# Altium schematic sheet DC.SchDoc
size 685 x 800 mm
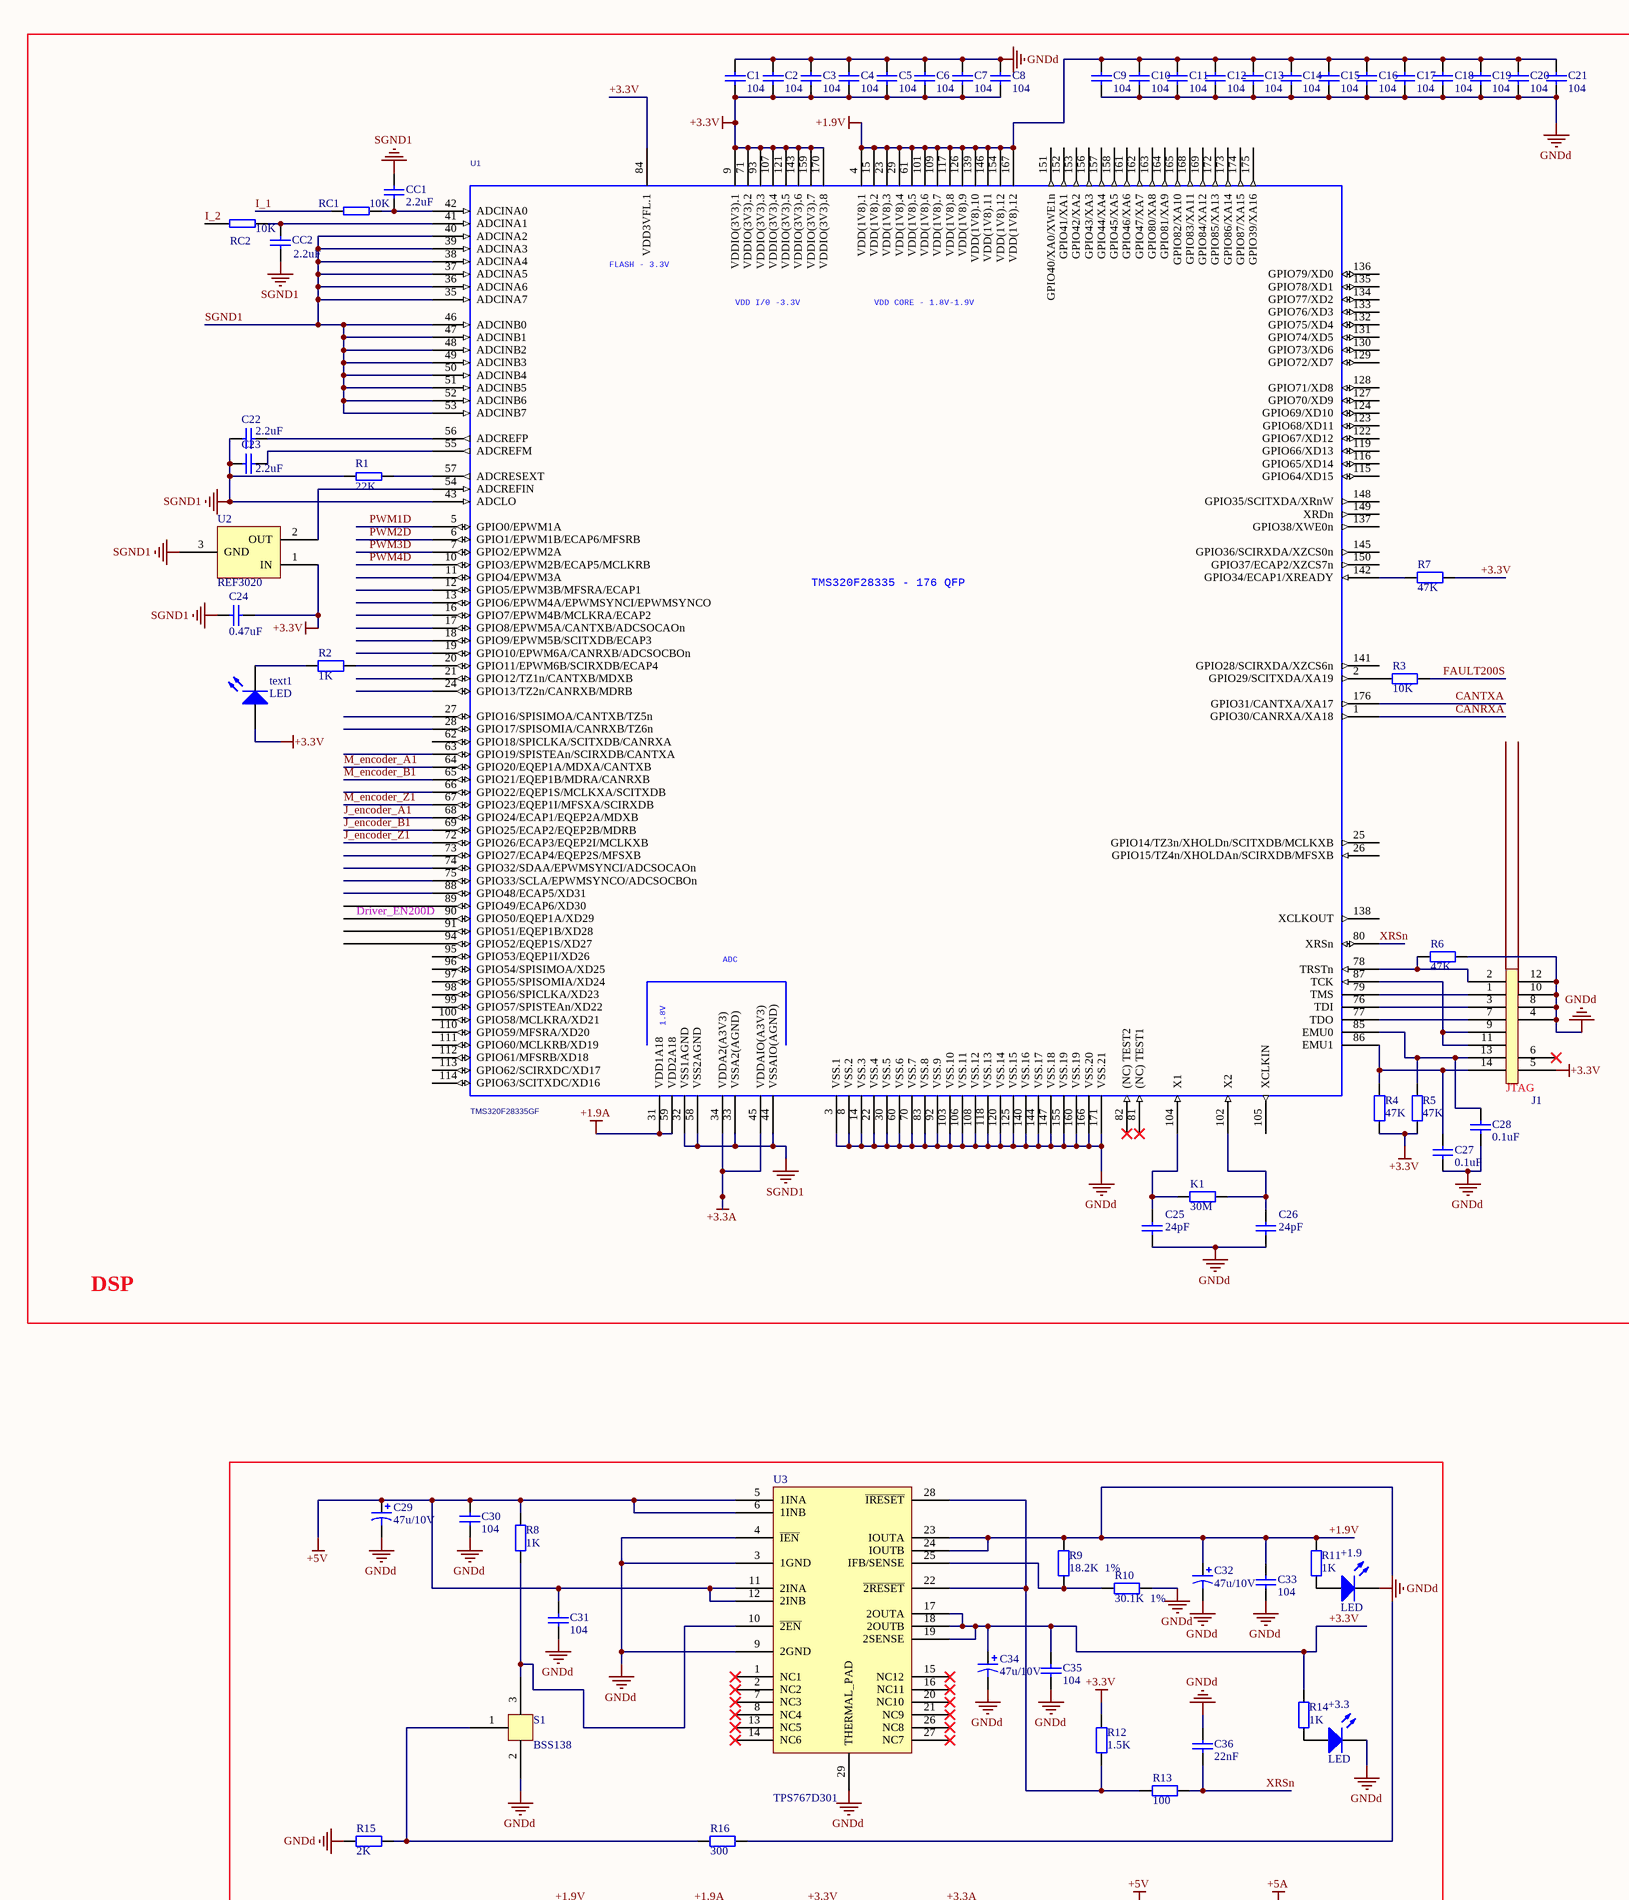
[diagram p0: DC.SchDoc, top left]
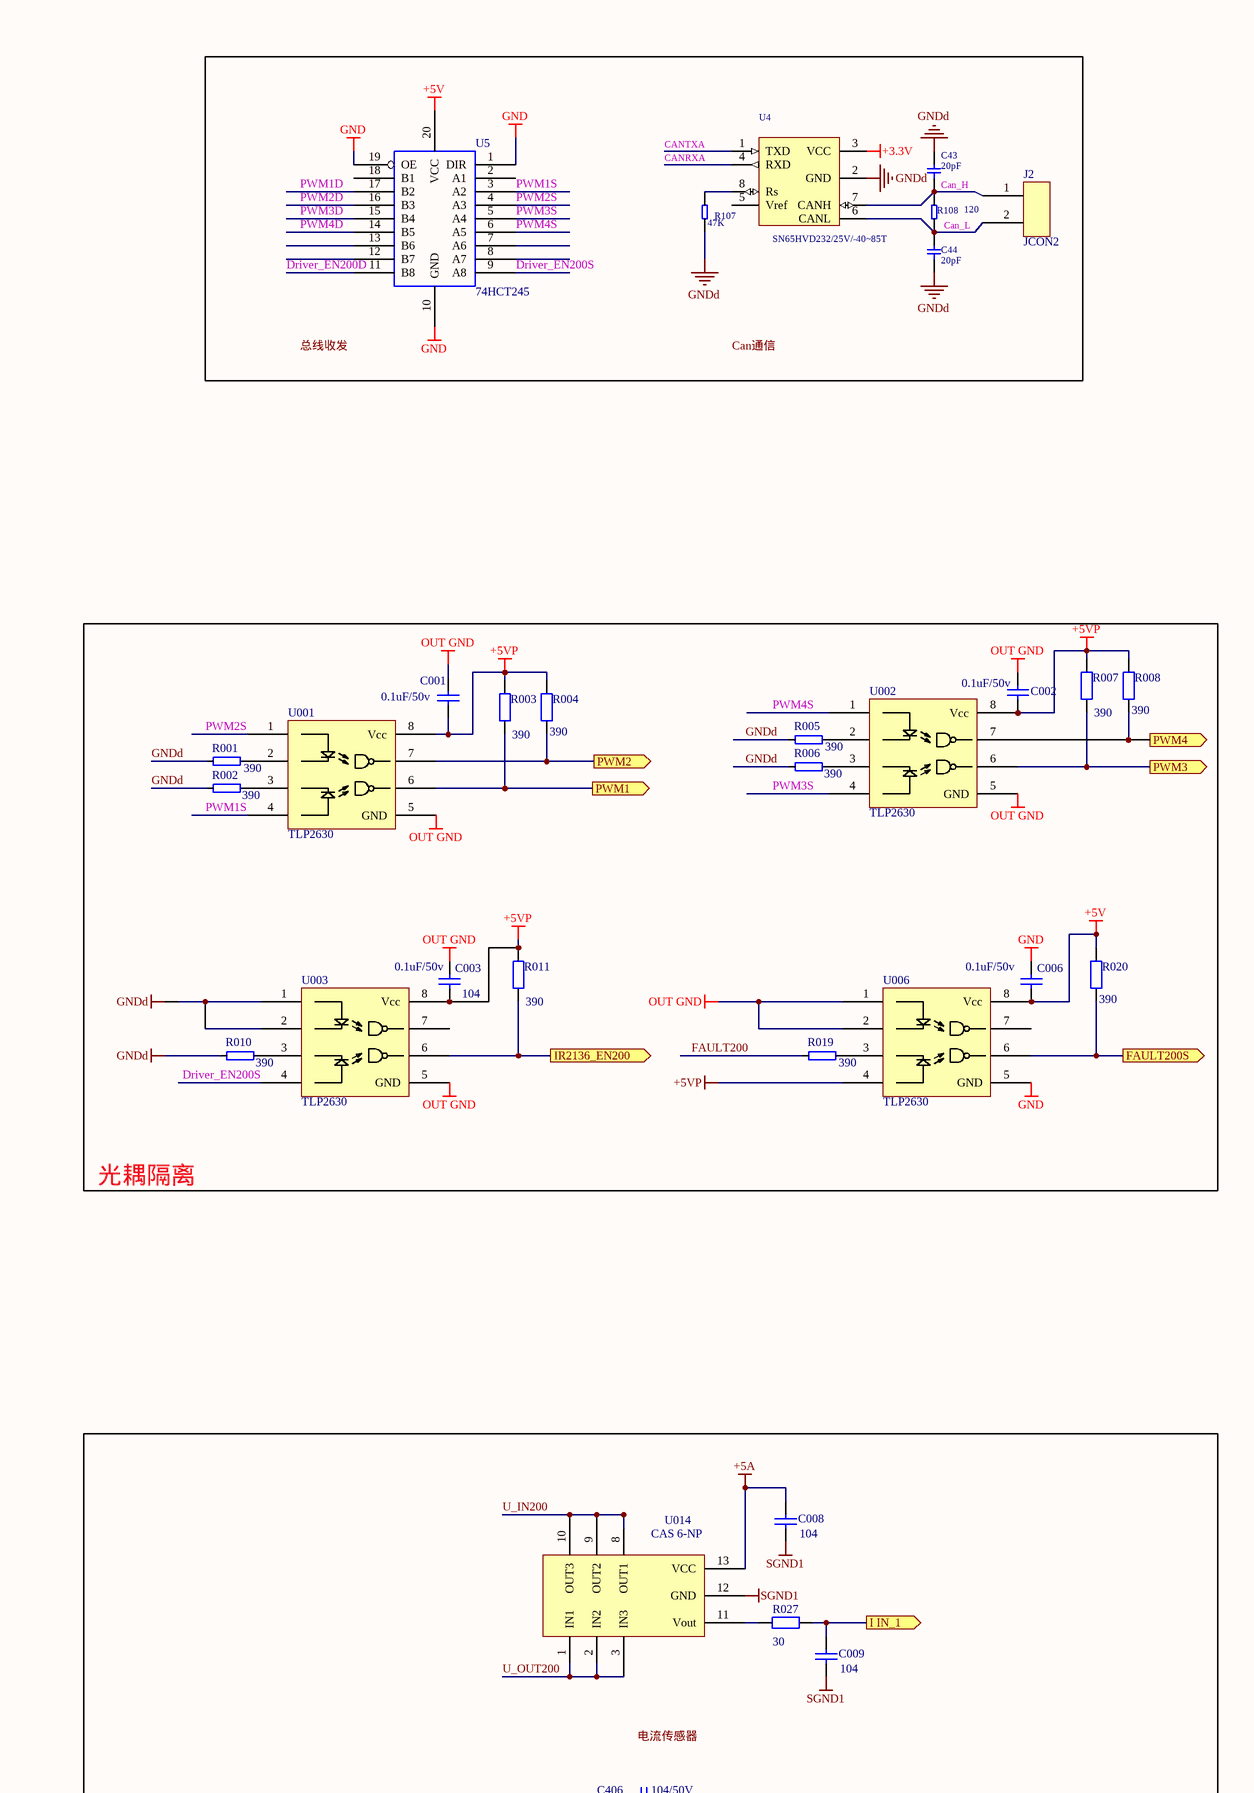
[diagram p1: DC.SchDoc, top right]
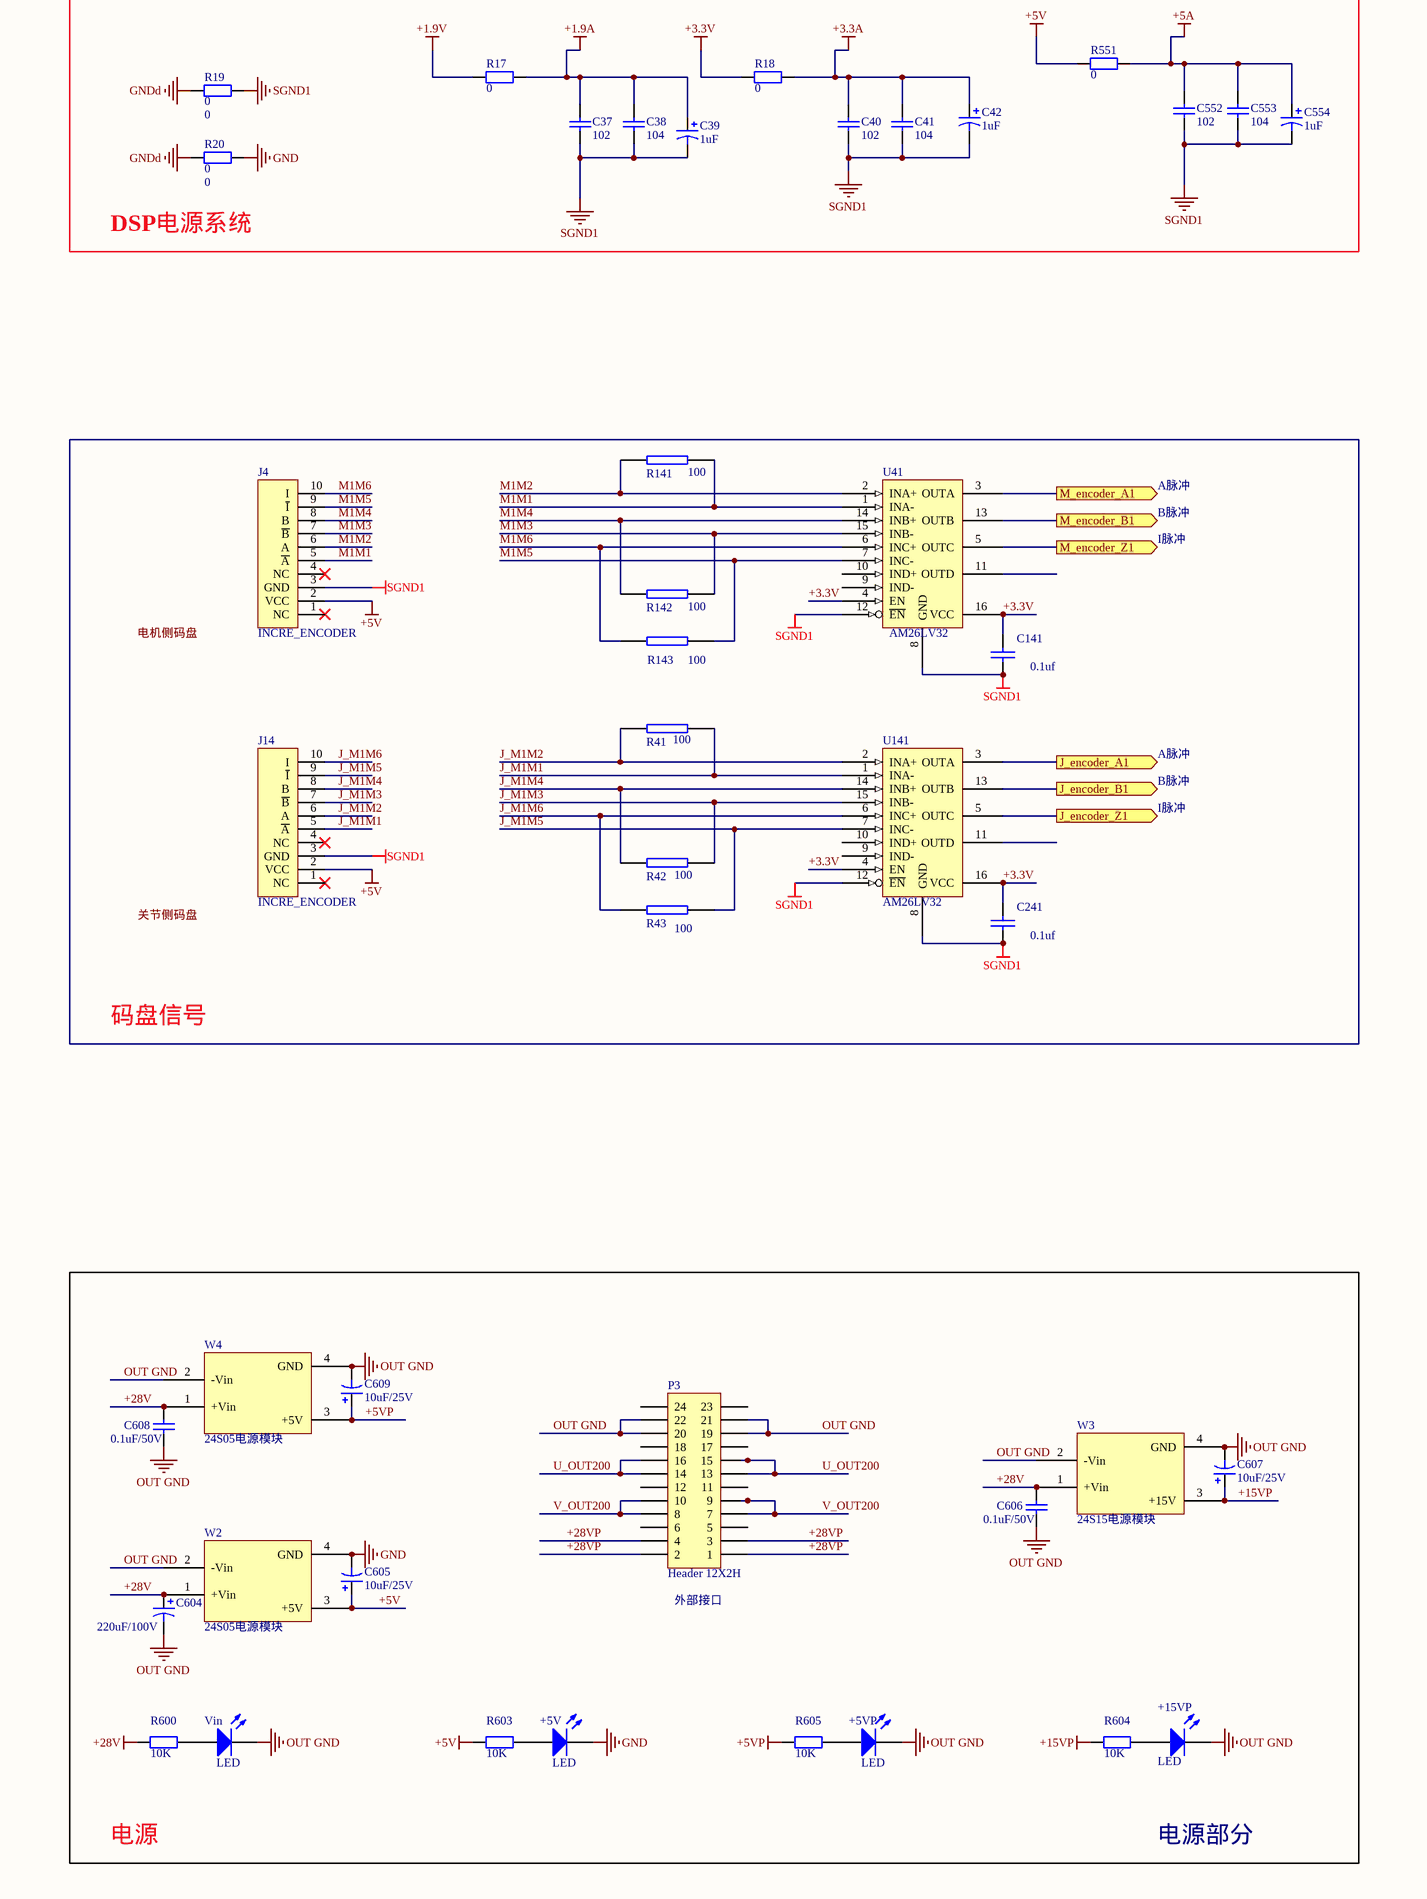
[diagram p2: DC.SchDoc, bottom left]
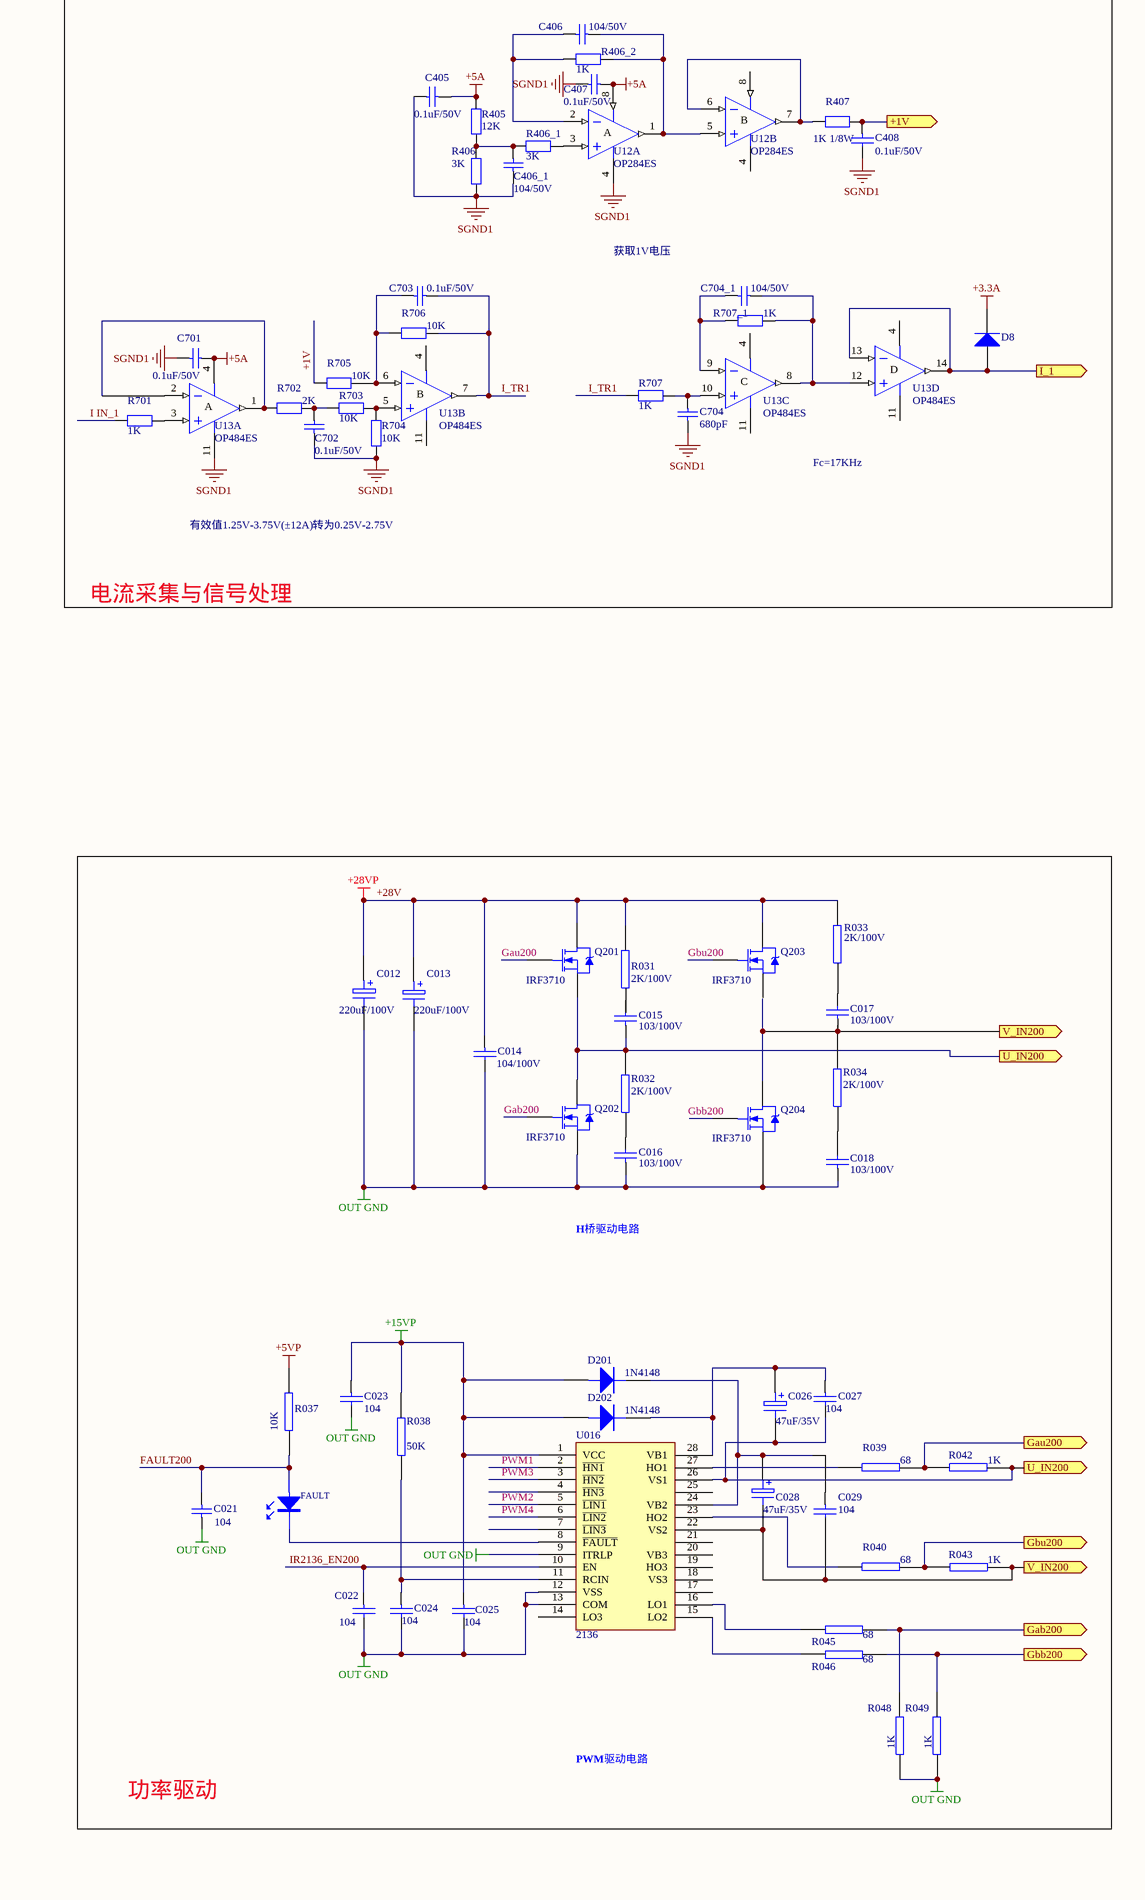
[diagram p3: DC.SchDoc, bottom right]

## Parts
+1.9  LED  [C0805 - LED]
+3.3  LED  [C0805 - LED]
+5V  LED  [C0805 - LED]
+5VP  LED  [C0805 - LED]
+15VP  LED  [C0805 - LED]
C1  104  [C0805]
C001  value 0.1uF/50v  [C0805]  (hidden comment: 104)
C2  104  [C0805]
C002  value 0.1uF/50v  [C0805]  (hidden comment: 104)
C3  104  [C0805]
C003  104  value 0.1uF/50v  [C0805]
C4  104  [C0805]
C5  104  [C0805]
C6  104  [C0805]
C006  value 0.1uF/50v  [C0805]  (hidden comment: 104)
C7  104  [C0805]
C8  104  [C0805]
C008  104  [C0805]
C9  104  [C0805]
C009  104  [C0805]
C10  104  [C0805]
C11  104  [C0805]
C12  104  [C0805]
C012  220uF/100V  [220uF/100V]
C13  104  [C0805]
C013  220uF/100V  [220uF/100V]
C14  104  [C0805]
C014  104/100V  [C0805]
C15  104  [C0805]
C015  103/100V  [C0805]
C16  104  [C0805]
C016  103/100V  [C0805]
C17  104  [C0805]
C017  103/100V  [C0805]
C18  104  [C0805]
C018  103/100V  [C0805]
C19  104  [C0805]
C20  104  [C0805]
C21  104  [C0805]
C021  104  [C0805]
C22  2.2uF  [6-0805]
C022  104  [C0805]
C23  2.2uF  [6-0805]
C023  104  [C0805]
C24  0.47uF  [C0805]
C024  104  [C0805]
C25  24pF  [C0805]
C025  104  [C0805]
C26  24pF  [C0805]
C026  47uF/35V  [7243]
C27  0.1uF  [C0805]
C027  104  [C0805]
C28  0.1uF  [C0805]
C028  47uF/35V  [7243]
C29  47u/10V  [钽电容2]
C029  104  [C0805]
C30  104  [C0805]
C31  104  [C0805]
C32  47u/10V  [钽电容2]
C33  104  [C0805]
C34  47u/10V  [钽电容2]
C35  104  [C0805]
C36  22nF  [C0805]
C37  102  [C0805]
C38  104  [C0805]
C39  1uF  [钽电容2]
C40  102  [C0805]
C41  104  [C0805]
C42  1uF  [钽电容2]
C43  20pF  [C0805]
C44  20pF  [C0805]
C141  0.1uF  [0603_LIU]
C241  0.1uF  [0603_LIU]
C405  0.1uF/50V  [C0805]
C406  104/50V  [C0805]
C406_1  104/50V  [C0805]
C407  0.1uF/50V  [C0805]
C408  0.1uF/50V  [C0805]
C552  102  [C0805]
C553  104  [C0805]
C554  1uF  [C0805]
C604  220uF/100V  [220uF/100V]
C605  10uF/25V  [25V10uF]
C606  0.1uF/50V  [C0805]
C607  10uF/25V  [25V10uF]
C608  0.1uF/50V  [C0805]
C609  10uF/25V  [25V10uF]
C701  0.1uF/50V  [C0805]
C702  0.1uF/50V  [C0805]
C703  0.1uF/50V  [C0805]
C704  680pF  [C0805]
C704_1  104/50V  [C0805]
CC1  2.2uF  [6-0805]
CC2  2.2uF  [6-0805]
D8  Diode  [1N58199]  (value not drawn)
D201  1N4148  [140T3]
D202  1N4148  [140T3]
FAULT  LED  [C0805 - LED]  (value not drawn)
J1  JTAG  [HDR2X7]
J2  JCON2  [J2]
J4  INCRE_ENCODER  [MAPAN]
J14  INCRE_ENCODER  [MAPAN]
K1  30M  [晶振]
P3  Header 12X2H  [HDR2X12H]
Q201  IRF3710  [D2Pak]
Q202  IRF3710  [D2Pak]
Q203  IRF3710  [D2Pak]
Q204  IRF3710  [D2Pak]
R1  22K  [0805]
R001  390  [0805]
R2  1K  [0805]
R002  390  [0805]
R003  390  [0805]
R3  10K  [0805]
R4  47K  [0805]
R004  390  [0805]
R5  47K  [0805]
R005  390  [0805]
R6  47K  [0805]
R006  390  [0805]
R7  47K  [0805]
R007  390  [0805]
R8  1K  [0805]
R008  390  [0805]
R9  18.2K  1%  [0805]
R10  30.1K  1%  [0805]
R010  390  [0805]
R11  1K  [0805]
R011  390  [0805]
R12  1.5K  [0805]
R13  100  [0805]
R14  1K  [0805]
R15  2K  [0805]
R16  300  [0805]
R17  0  [0805]
R18  0  [0805]
R19  0  [0805]
R019  390  [0805]
R020  390  [0805]
R20  0  [0805]
R027  30  [0805]
R031  2K/100V  [0805]
R032  2K/100V  [0805]
R033  2K/100V  [0805]
R034  2K/100V  [0805]
R037  10K  [0805]
R038  50K  [0805]
R039  68  [0805]
R040  68  [0805]
R41  100  [0603_LIU]
R042  1K  [0805]
R42  100  [0603_LIU]
R043  1K  [0805]
R43  100  [0603_LIU]
R045  68  [0805]
R046  68  [0805]
R048  1K  [0805]
R049  1K  [0805]
R107  47K  [0805]
R108  120  [0805]
R141  100  [0603_LIU]
R142  100  [0603_LIU]
R143  100  [0603_LIU]
R405  12K  [0805]
R406  3K  [0805]
R406_1  3K  [0805]
R406_2  1K  [0805]
R407  1K 1/8W  [0805]
R551  0  [C0805]
R600  10K  [0805]
R603  10K  [0805]
R604  10K  [0805]
R605  10K  [0805]
R701  1K  [0805]
R702  2K  [0805]
R703  10K  [0805]
R704  10K  [0805]
R705  10K  [0805]
R706  10K  [0805]
R707  1K  [0805]
R707_1  1K  [0805]
RC1  10K  [0805]
RC2  10K  [0805]
S1  BSS138  [SOT-23]
text1  LED  [C0805 - LED]
U1  TMS320F28335GF  [QFP176]
U001  TLP2630  [SO-8]
U2  REF3020  [SOT-23]
U002  TLP2630  [SO-8]
U3  TPS767D301  [TSSOP28A]
U003  TLP2630  [SO-8]
U4  SN65HVD232/25V/-40~85T  [SO-8]
U5  74HCT245  [SOJ-20]
U006  TLP2630  [SO-8]
U12  OP284ES  [SO-8_N]  (parts A,B of 2)
U13  OP484ES  [SO-14_N]  (parts A,B,C,D of 4)
U014  CAS 6-NP  [电流传感器]
U016  2136  [SO-G28/D18.1]
U41  AM26LV32  [SO-16]
U141  AM26LV32  [SO-16]
Vin  LED  [C0805 - LED]
W2  24S05电源模块  [24S]
W3  24S15电源模块  [24S]
W4  24S05电源模块  [24S]

## Blocks framed on the sheet
光耦隔离: C001 C002 C003 C006 R001 R002 R003 R004 R005 R006 R007 R008 R010 R011 R019 R020 U001 U002 U003 U006
电流采集与信号处理: C008 C009 C405 C406 C406_1 C407 C408 C701-C704 C704_1 D8 R027 R405 R406 R406_1 R406_2 R407 R701-R707 R707_1 U12 U13 U014
DSP电源系统: +1.9 +3.3 C29-C42 C552-C554 R8-R20 R551 S1 U3
功率驱动: C012 C013 C014 C015 C016 C017 C018 C021 C022 C023 C024 C025 C026 C027 C028 C029 D201 D202 FAULT Q201-Q204 R031 R032 R033 R034 R037 R038 R039 R040 R042 R043 R045 R046 R048 R049 U016

## Ports
+1V (out), FAULT200S (out), Gab200 (out), Gau200 (out), Gbb200 (out), Gbu200 (out), I IN_1 (out), I_1 (out), IR2136_EN200 (out), J_encoder_A1 (out), J_encoder_B1 (out), J_encoder_Z1 (out), M_encoder_A1 (out), M_encoder_B1 (out), M_encoder_Z1 (out), PWM1 (out), PWM2 (out), PWM3 (out), PWM4 (out), U_IN200 (out), V_IN200 (out)

## Nets
+1.9A: C37.2 C38.2 C39.1 R17.2 U1.31(VDD1A18) U1.59(VDD2A18)
+1.9V: C9.2 C10.2 C11.2 C12.2 C13.2 C14.2 C15.2 C16.2 C17.1 C18.2 C19.2 C20.2 C21.2 C32.1 C33.2 R9.2 R11.2 R16.2 R17.1 U1.4(VDD(1V8).1) U1.15(VDD(1V8).2) U1.23(VDD(1V8).3) U1.29(VDD(1V8).4) U1.61(VDD(1V8).5) U1.101(VDD(1V8).6) U1.109(VDD(1V8).7) U1.117(VDD(1V8).8) U1.126(VDD(1V8).9) U1.139(VDD(1V8).10) U1.146(VDD(1V8).11) U1.154(VDD(1V8).12) U1.167(VDD(1V8).12) U3.23(IOUTA) U3.24(IOUTB)
+3.3A: C40.2 C41.2 C42.1 D8.2(K) R18.2 U1.34(VDDA2(A3V3)) U1.45(VDDAIO(A3V3))
+3.3V: C1.1 C2.1 C3.1 C4.1 C5.1 C6.1 C7.1 C8.1 C24.1 C34.1 C35.2 C141.1 C241.1 J1.5 R4.1 R5.1 R7.2 R12.2 R14.2 R18.1 text1.1(A) U1.9(VDDIO(3V3).1) U1.71(VDDIO(3V3).2) U1.84(VDD3VFL.1) U1.93(VDDIO(3V3).3) U1.107(VDDIO(3V3).4) U1.121(VDDIO(3V3).5) U1.143(VDDIO(3V3).6) U1.159(VDDIO(3V3).7) U1.170(VDDIO(3V3).8) U2.1(IN) U3.17(2OUTA) U3.18(2OUTB) U3.19(2SENSE) U4.3(VCC) U41.4(EN) U41.16(VCC) U141.4(EN) U141.16(VCC)
+5A: C008.2 C405.1 C407.2 C552.2 C553.2 C554.1 C701.2 R405.2 R551.2 U12.8(V+) U13.4(V+) U014.13(VCC)
+5V: C006.1 C29.1 C30.2 C31.2 C605.1 J4.2(VCC) J14.2(VCC) R8.2 R020.2 R551.1 R603.1 U3.5(1INA) U3.6(1INB) U3.11(2INA) U3.12(2INB) U5.20(VCC) U006.8(Vcc) W2.3(+5V)
+5VP: C001.1 C002.1 C003.1 C609.1 R003.2 R004.2 R007.2 R008.2 R011.2 R037.2 R605.1 U001.8(Vcc) U002.8(Vcc) U003.8(Vcc) U006.4(ANODE2) W4.3(+5V)
+15VP: C023.1 C025.1 C607.1 D201.1(A) D202.1(A) R038.2 R604.1 U016.1(VCC) W3.3(+15V)
+28V: C012.1 C013.1 C014.1 C604.1 C606.2 C608.2 P3.1 P3.2 P3.3 P3.4 Q201.2(D) Q203.2(D) R031.2 R033.2 R600.1 W2.1(+Vin) W3.1(+Vin) W4.1(+Vin)  [also labelled +28VP]
GND: +5V.2(K) C006.2 C605.2 R20.2 U5.1(DIR) U5.10(GND) U5.19(OE) U006.5(GND) W2.4(GND)
GNDd: +1.9.2(K) +3.3.2(K) C1.2 C2.2 C3.2 C4.2 C5.2 C6.2 C7.2 C8.2 C9.1 C10.1 C11.1 C12.1 C13.1 C14.1 C15.1 C16.1 C17.2 C18.1 C19.1 C20.1 C21.1 C25.1 C26.1 C27.1 C28.1 C29.2 C30.1 C31.1 C32.2 C33.1 C34.2 C35.1 C36.2 C43.2 C44.1 J1.4 J1.8 J1.10 J1.12 R001.2 R002.2 R005.2 R6.2 R006.2 R10.2 R010.2 R15.2 R19.1 R20.1 R107.1 S1.2 U1.3(VSS.1) U1.8(VSS.2) U1.14(VSS.3) U1.22(VSS.4) U1.30(VSS.5) U1.60(VSS.6) U1.70(VSS.7) U1.83(VSS.8) U1.92(VSS.9) U1.103(VSS.10) U1.106(VSS.11) U1.108(VSS.12) U1.118(VSS.13) U1.120(VSS.14) U1.125(VSS.15) U1.140(VSS.16) U1.144(VSS.17) U1.147(VSS.18) U1.155(VSS.19) U1.160(VSS.19) U1.166(VSS.20) U1.171(VSS.21) U003.1(ANODE1) U003.2(CATHODE1) U3.3(1GND) U3.4(~{IEN}) U3.9(2GND) U3.29(THERMAL_PAD) U4.2(GND)
OUT GND: +5VP.2(K) +15VP.2(K) C001.2 C002.2 C003.2 C012.2 C013.2 C014.2 C016.1 C018.1 C021.1 C022.2 C023.2 C024.2 C025.2 C604.2 C606.1 C607.2 C608.1 C609.2 P3.19 P3.20 P3.21 P3.22 Q202.3(S) Q204.3(S) R048.1 R049.1 U001.5(GND) U002.5(GND) U003.5(GND) U006.1(ANODE1) U006.2(CATHODE1) U016.9(ITRLP) U016.12(VSS) U016.13(COM) Vin.2(K) W2.2(-Vin) W3.2(-Vin) W3.4(GND) W4.2(-Vin) W4.4(GND)
SGND1: C008.1 C009.1 C22.1 C23.1 C24.2 C37.1 C38.1 C39.2 C40.1 C41.1 C42.2 C141.2 C241.2 C405.2 C406_1.1 C407.1 C408.2 C552.1 C553.1 C554.2 C701.1 C702.2 C704.1 CC1.2 CC2.1 J4.3(GND) J14.3(GND) R1.1(TOP) R19.2 R406.1 R704.1 U1.32(VSS1AGND) U1.33(VSSA2(AGND)) U1.35(ADCINA7) U1.36(ADCINA6) U1.37(ADCINA5) U1.38(ADCINA4) U1.39(ADCINA3) U1.40(ADCINA2) U1.43(ADCLO) U1.44(VSSAIO(AGND)) U1.46(ADCINB0) U1.47(ADCINB1) U1.48(ADCINB2) U1.49(ADCINB3) U1.50(ADCINB4) U1.51(ADCINB5) U1.52(ADCINB6) U1.53(ADCINB7) U1.58(VSS2AGND) U2.3(GND) U12.4(V-) U13.11(V-) U014.12(GND) U41.8(GND) U41.12(~{EN}) U141.8(GND) U141.12(~{EN})
+1V: R705.1
+1V: C408.1 R407.2 ; port +1V  [a separate net that carries the same name]
Can_H: C43.1 J2.1 R108.2 U4.7(CANH)
Can_L: C44.2 J2.2 R108.1 U4.6(CANL)
CANRXA: U1.1(GPIO30/CANRXA/XA18) U4.4(RXD)
CANTXA: U1.176(GPIO31/CANTXA/XA17) U4.1(TXD)
Driver_EN200D: U1.90(GPIO50/EQEP1A/XD29) U5.11(B8)
Driver_EN200S: U003.4(ANODE2) U5.9(A8)
FAULT200: C021.2 FAULT.1 R019.2 R037.1
FAULT200S: R020.1 U006.6(Vo2) ; port FAULT200S
FAULT200S: R3.2  [a separate net that carries the same name]
Gab200: Q202.1(G)
Gab200: R045.2 R048.2 ; port Gab200  [a separate net that carries the same name]
Gau200: Q201.1(G)
Gau200: R039.1 R042.2 ; port Gau200  [a separate net that carries the same name]
Gbb200: R046.2 R049.2 ; port Gbb200
Gbu200: Q203.1(G)
Gbu200: R040.1 R043.1 ; port Gbu200  [a separate net that carries the same name]
I IN_1: C009.2 R027.2 ; port I IN_1
I IN_1: R701.1  [a separate net that carries the same name]
I_1: RC1.1(TOP)
I_1: D8.1(A) U13.13(IN-) U13.14(OUT) ; port I_1  [a separate net that carries the same name]
I_2: RC2.1(TOP)
I_TR1: C703.1 R706.2 R707.2 U13.7(OUT)
IR2136_EN200: R011.1 U003.6(Vo2) ; port IR2136_EN200
IR2136_EN200: C022.1 U016.10(EN)  [a separate net that carries the same name]
J_encoder_A1: U1.68(GPIO24/ECAP1/EQEP2A/MDXB)
J_encoder_A1: U141.3(OUTA) ; port J_encoder_A1  [a separate net that carries the same name]
J_encoder_B1: U1.69(GPIO25/ECAP2/EQEP2B/MDRB)
J_encoder_B1: U141.13(OUTB) ; port J_encoder_B1  [a separate net that carries the same name]
J_encoder_Z1: U1.72(GPIO26/ECAP3/EQEP2I/MCLKXB)
J_encoder_Z1: U141.5(OUTC) ; port J_encoder_Z1  [a separate net that carries the same name]
J_M1M1: J14.5(~{A}) R41.2 U141.1(INA-)
J_M1M2: J14.6(A) R41.1 U141.2(INA+)
J_M1M3: J14.7(~{B}) R42.2 U141.15(INB-)
J_M1M4: J14.8(B) R42.1 U141.14(INB+)
J_M1M5: J14.9(~{I}) R43.2 U141.7(INC-)
J_M1M6: J14.10(I) R43.1 U141.6(INC+)
M1M1: J4.5(~{A}) R141.2 U41.1(INA-)
M1M2: J4.6(A) R141.1 U41.2(INA+)
M1M3: J4.7(~{B}) R142.2 U41.15(INB-)
M1M4: J4.8(B) R142.1 U41.14(INB+)
M1M5: J4.9(~{I}) R143.2 U41.7(INC-)
M1M6: J4.10(I) R143.1 U41.6(INC+)
M_encoder_A1: U1.64(GPIO20/EQEP1A/MDXA/CANTXB)
M_encoder_A1: U41.3(OUTA) ; port M_encoder_A1  [a separate net that carries the same name]
M_encoder_B1: U1.65(GPIO21/EQEP1B/MDRA/CANRXB)
M_encoder_B1: U41.13(OUTB) ; port M_encoder_B1  [a separate net that carries the same name]
M_encoder_Z1: U1.67(GPIO23/EQEP1I/MFSXA/SCIRXDB)
M_encoder_Z1: U41.5(OUTC) ; port M_encoder_Z1  [a separate net that carries the same name]
PWM1: R003.1 U001.6(Vo2) ; port PWM1
PWM1: U016.2(~{HN1})  [a separate net that carries the same name]
PWM1D: U1.5(GPIO0/EPWM1A) U5.17(B2)
PWM1S: U001.4(ANODE2) U5.3(A2)
PWM2: R004.1 U001.7(Vo1) ; port PWM2
PWM2: U016.5(~{LIN1})  [a separate net that carries the same name]
PWM2D: U1.6(GPIO1/EPWM1B/ECAP6/MFSRB) U5.16(B3)
PWM2S: U001.1(ANODE1) U5.4(A3)
PWM3: R007.1 U002.6(Vo2) ; port PWM3
PWM3: U016.3(~{HN2})  [a separate net that carries the same name]
PWM3D: U1.7(GPIO2/EPWM2A) U5.15(B4)
PWM3S: U002.4(ANODE2) U5.5(A4)
PWM4: R008.1 U002.7(Vo1) ; port PWM4
PWM4: U016.6(~{LIN2})  [a separate net that carries the same name]
PWM4D: U1.10(GPIO3/EPWM2B/ECAP5/MCLKRB) U5.14(B5)
PWM4S: U002.1(ANODE1) U5.6(A5)
U_IN200: C015.1 C026.2 C027.2 Q201.3(S) Q202.2(D) R032.2 R042.1 U016.26(VS1) ; port U_IN200
U_IN200: U014.8(OUT1) U014.9(OUT2) U014.10(OUT3)  [a separate net that carries the same name]
U_OUT200: P3.13 P3.14 P3.15 P3.16 U014.1(IN1) U014.2(IN2) U014.3(IN3)
V_IN200: C017.1 C028.2 C029.2 Q204.2(D) R034.2 R043.2 U016.22(VS2) ; port V_IN200
V_OUT200: P3.7 P3.8 P3.9 P3.10
XRSn: C36.1 R13.2 U1.80(XRSn)
Net+1.9_1: +1.9.1(A) R11.1
Net+3.3_1: +3.3.1(A) R14.1
Net+5V_1: +5V.1(A) R603.2
Net+5VP_1: +5VP.1(A) R605.2
Net+15VP_1: +15VP.1(A) R604.2
NetC015_2: C015.2 R031.1
NetC016_2: C016.2 R032.1
NetC017_2: C017.2 R033.1
NetC018_2: C018.2 R034.1
NetC22_2: C22.2 U1.56(ADCREFP)
NetC23_2: C23.2 U1.55(ADCREFM)
NetC024_1: C024.1 R038.1 U016.11(RCIN)
NetC25_2: C25.2 K1.2 U1.104(X1)
NetC026_1: C026.1 C027.1 D202.2(K) U016.28(VB1)
NetC26_2: C26.2 K1.1 U1.102(X2)
NetC27_2: C27.2 J1.14 R4.2 U1.86(EMU1)
NetC028_1: C028.1 C029.1 D201.2(K) U016.24(VB2)
NetC28_2: C28.2 J1.13 R5.2 U1.85(EMU0)
NetC406_1: C406.1 R406_2.1 U12.1(OUT) U12.5(IN+)
NetC406_1_2: C406_1.2 R405.1 R406.2 R406_1.2
NetC406_2: C406.2 R406_2.2 U12.2(IN-)
NetC702_1: C702.1 R702.2 R703.2
NetC703_2: C703.2 R705.2 R706.1 U13.6(IN-)
NetC704_1_1: C704_1.1 R707_1.1 U13.8(OUT) U13.12(IN+)
NetC704_1_2: C704_1.2 R707_1.2 U13.9(IN-)
NetC704_2: C704.2 R707.1 U13.10(IN+)
NetCC1_1: CC1.1 RC1.2(BOT) U1.42(ADCINA0)
NetCC2_2: CC2.2 RC2.2(BOT) U1.41(ADCINA1)
NetFAULT_2: FAULT.2 U016.8(~{FAULT})
NetJ1_1: J1.1 U1.79(TMS)
NetJ1_2: J1.2 R6.1 U1.78(TRSTn)
NetJ1_3: J1.3 U1.76(TDI)
NetJ1_7: J1.7 U1.77(TDO)
NetJ1_9: J1.9 J1.11 U1.87(TCK)
NetR001_1: R001.1 U001.2(CATHODE1)
NetR1_2: R1.2(BOT) U1.57(ADCRESEXT)
NetR2_1: R2.1 text1.2(K)
NetR002_1: R002.1 U001.3(CATHODE2)
NetR2_2: R2.2 U1.20(GPIO11/EPWM6B/SCIRXDB/ECAP4)
NetR3_1: R3.1 U1.2(GPIO29/SCITXDA/XA19)
NetR005_1: R005.1 U002.2(CATHODE1)
NetR006_1: R006.1 U002.3(CATHODE2)
NetR7_1: R7.1 U1.142(GPIO34/ECAP1/XREADY)
NetR8_1: R8.1 S1.3 U3.10(~{2EN})
NetR9_1: R9.1 R10.1 U3.25(IFB/SENSE)
NetR010_1: R010.1 U003.3(CATHODE2)
NetR12_1: R12.1 R13.1 U3.22(~{2RESET}) U3.28(~{IRESET})
NetR15_1: R15.1 R16.1 S1.1
NetR019_1: R019.1 U006.3(CATHODE2)
NetR027_1: R027.1 U014.11(Vout)
NetR039_2: R039.2 U016.27(HO1)
NetR040_2: R040.2 U016.23(HO2)
NetR045_1: R045.1 U016.16(LO1)
NetR046_1: R046.1 U016.15(LO2)
NetR107_2: R107.2 U4.8(Rs)
NetR406_1_1: R406_1.1 U12.3(IN+)
NetR407_1: R407.1 U12.6(IN-) U12.7(OUT)
NetR600_2: R600.2 Vin.1(A)
NetR701_2: R701.2 U13.3(IN+)
NetR702_1: R702.1 U13.1(OUT) U13.2(IN-)
NetR703_1: R703.1 R704.2 U13.5(IN+)
NetU1_54: U1.54(ADCREFIN) U2.2(OUT)

Not connected (* = marked no-connect by the designer): J1 6*; J4 1(NC)* 4(NC)*; J14 1(NC)* 4(NC)*; P3 5 6 11 12 17 18 23 24; Q203 3(S); Q204 1(G); U1 11(GPIO4/EPWM3A) 12(GPIO5/EPWM3B/MFSRA/ECAP1) 13(GPIO6/EPWM4A/EPWMSYNCI/EPWMSYNCO) 16(GPIO7/EPWM4B/MCLKRA/ECAP2) 17(GPIO8/EPWM5A/CANTXB/ADCSOCAOn) 18(GPIO9/EPWM5B/SCITXDB/ECAP3) 19(GPIO10/EPWM6A/CANRXB/ADCSOCBOn) 21(GPIO12/TZ1n/CANTXB/MDXB) 24(GPIO13/TZ2n/CANRXB/MDRB) 25(GPIO14/TZ3n/XHOLDn/SCITXDB/MCLKXB) 26(GPIO15/TZ4n/XHOLDAn/SCIRXDB/MFSXB) 27(GPIO16/SPISIMOA/CANTXB/TZ5n) 28(GPIO17/SPISOMIA/CANRXB/TZ6n) 62(GPIO18/SPICLKA/SCITXDB/CANRXA) 63(GPIO19/SPISTEAn/SCIRXDB/CANTXA) 66(GPIO22/EQEP1S/MCLKXA/SCITXDB) 73(GPIO27/ECAP4/EQEP2S/MFSXB) 74(GPIO32/SDAA/EPWMSYNCI/ADCSOCAOn) 75(GPIO33/SCLA/EPWMSYNCO/ADCSOCBOn) 81((NC)_TEST1)* 82((NC)_TEST2)* 88(GPIO48/ECAP5/XD31) 89(GPIO49/ECAP6/XD30) 91(GPIO51/EQEP1B/XD28) 94(GPIO52/EQEP1S/XD27) 95(GPIO53/EQEP1I/XD26) 96(GPIO54/SPISIMOA/XD25) 97(GPIO55/SPISOMIA/XD24) 98(GPIO56/SPICLKA/XD23) 99(GPIO57/SPISTEAn/XD22) 100(GPIO58/MCLKRA/XD21) 105(XCLKIN) 110(GPIO59/MFSRA/XD20) 111(GPIO60/MCLKRB/XD19) 112(GPIO61/MFSRB/XD18) 113(GPIO62/SCIRXDC/XD17) 114(GPIO63/SCITXDC/XD16) 115(GPIO64/XD15) 116(GPIO65/XD14) 119(GPIO66/XD13) 122(GPIO67/XD12) 123(GPIO68/XD11) 124(GPIO69/XD10) 127(GPIO70/XD9) 128(GPIO71/XD8) 129(GPIO72/XD7) 130(GPIO73/XD6) 131(GPIO74/XD5) 132(GPIO75/XD4) 133(GPIO76/XD3) 134(GPIO77/XD2) 135(GPIO78/XD1) 136(GPIO79/XD0) 137(GPIO38/XWE0n) 138(XCLKOUT) 141(GPIO28/SCIRXDA/XZCS6n) 145(GPIO36/SCIRXDA/XZCS0n) 148(GPIO35/SCITXDA/XRnW) 149(XRDn) 150(GPIO37/ECAP2/XZCS7n) 151(GPIO40/XA0/XWE1n) 152(GPIO41/XA1) 153(GPIO42/XA2) 156(GPIO43/XA3) 157(GPIO44/XA4) 158(GPIO45/XA5) 161(GPIO46/XA6) 162(GPIO47/XA7) 163(GPIO80/XA8) 164(GPIO81/XA9) 165(GPIO82/XA10) 168(GPIO83/XA11) 169(GPIO84/XA12) 172(GPIO85/XA13) 173(GPIO86/XA14) 174(GPIO87/XA15) 175(GPIO39/XA16); U3 1(NC1)* 2(NC2)* 7(NC3)* 8(NC4)* 13(NC5)* 14(NC6)* 15(NC12)* 16(NC11)* 20(NC10)* 21(NC9)* 26(NC8)* 27(NC7)*; U003 7(Vo1); U4 5(Vref); U5 2(A1) 7(A6) 8(A7) 12(B7) 13(B6) 18(B1); U006 7(Vo1); U016 4(~{HN3}) 7(~{LIN3}) 14(LO3) 17 18(VS3) 19(HO3) 20(VB3) 21 25; U41 9(IND-) 10(IND+) 11(OUTD); U141 9(IND-) 10(IND+) 11(OUTD)

## Notes on the sheet
- DSP
- 获取1V电压
- Fc=17KHz
- 有效值1.25V-3.75V(±12A)转为0.25V-2.75V
- A脉冲
- B脉冲
- I脉冲
- 码盘信号
- (near P3) 外部接口
- 电源
- 电源部分
- Labels drawn without touching a wire or pin: Can通信, Gbb200, H桥驱动电路, PWM驱动电路, 关节侧码盘, 总线收发, 电机侧码盘, 电流传感器
- (in symbol OP284ES, part A) A
- (in symbol OP284ES, part B) B
- (in symbol OP484ES, part A) A
- (in symbol OP484ES, part B) B
- (in symbol OP484ES, part C) C
- (in symbol OP484ES, part D) D
- (in symbol TMS320F283XXPGF_23) FLASH - 3.3V; VDD I/0 -3.3V; VDD CORE - 1.8V-1.9V; TMS320F28335 - 176 QFP; ADC; 1.8V

## Library data of the parts
+1.9 +3.3 +5V +5VP +15VP text1 Vin = LED2: Typical RED, GREEN, YELLOW, AMBER GaAs LED; Published: 8-Jun-2000; LatestRevisionDate: 17-Jul-2002; LatestRevisionNote: Re-released for DXP Platform.; PackageReference: 3.2X1.6X1.1; Publisher: Altium Limited
  +1.9 +3.3: PackageDocument: Feb-2002; value: LED
  +5V +5VP +15VP Vin: PackageVersion: Feb-2002; Value: LED
  text1: PackageDocument: Feb-2002
C1-C8 C008 C9 C009-C21 C021-C28 C30 C31 C33 C35-C38 C40 C41 C407 C552 C553 C606 C608 C701-C704 CC1 CC2 = Cap: Capacitor; Published: 8-Jun-2000; LatestRevisionDate: 17-Jul-2002; LatestRevisionNote: Re-released for DXP Platform.; PackageReference: RAD-0.3; Publisher: Altium Limited
  C008 C009 C021: Value: 104
  C407 C606 C608 C701-C703: Value: 0.1uF/50V
  C704: Value: 680pF
C001 C002 C003 C006 = C_0.1uF: Capacitor (Semiconductor SIM Model); Published: 8-Jun-2000; LatestRevisionDate: 17-Jul-2002; LatestRevisionNote: Re-released for DXP Platform.; PackageReference: C1206; Publisher: Altium Limited
C012 C013 C026 C028 = ELECTRO1: Electrolytic Capacitor
C014 C015 C016 C017 C018 C022 C023 C024 C025 C027 C029 C141 C241 C408 = CAP: Capacitor
  C141 C241: value: 0.1uf
  C408: value: 0.1uF/50V
C29 C32 C34 C554 C604 C605 C607 C609 = Cap Pol1: Polarized Capacitor (Radial); Published: 8-Jun-2000; LatestRevisionDate: 17-Jul-2002; LatestRevisionNote: Re-released for DXP Platform.; PackageReference: RB7.6-15; Publisher: Altium Limited
  C604: Value: 220uF/100V
  C605 C607 C609: Value: 10uF/25V
C39 C42 = Cap Pol1: Tantalum capacitor; Published: 8-Jun-2000; LatestRevisionDate: 17-Jul-2002; LatestRevisionNote: Re-released for DXP Platform.; PackageReference: RB7.6-15; Publisher: Altium Limited
C43 C44 = SCAP: Capacitor
C405 C406 C406_1 C704_1 = Cap Semi: Capacitor (Semiconductor SIM Model); Manufacturer: Generic Components; Class I: Passive; Published: 8-Jun-2000; Revision: July-2002: Re-released for DXP Platform.; Publisher: Altium Limited; Class II: Capacitor
  C405: Value: 0.1uF/50V
  C406 C406_1 C704_1: Value: 104/50V
D8 = Diode: 1N5819; Published: 8-Jun-2000; LatestRevisionDate: 17-Jul-2002; LatestRevisionNote: Re-released for DXP Platform.; PackageVersion: Sep-1996; PackageReference: SMC; Publisher: Altium Limited; Code_JEDEC: DO-214-AB
D201 D202 = DIODE
K1 R2-R20 R027 R405 R406 R406_1 R406_2 R551 R600 R603-R605 R701-R707 R707_1 = Res2: Resistor; Published: 8-Jun-2000; LatestRevisionDate: 17-Jul-2002; LatestRevisionNote: Re-released for DXP Platform.; PackageReference: AXIAL-0.4; Publisher: Altium Limited
  R19 R20: Value: 0
  R027: Value: 30
  R405: Value: 12K
  R406 R406_1: Value: 3K
  R406_2 R701 R707 R707_1: Value: 1K
  R600 R603-R605 R703-R706: Value: 10K
  R702: Value: 2K
P3 = Header 12X2H: Header, 12-Pin, Dual row, Right Angle; LatestRevisionDate: 17-Jul-2002; LatestRevisionNote: Re-released for DXP Platform.; Publisher: Altium Limited
Q201-Q204 = IRF3710: HEXFET Power MOSFET; Note: Pin 2 is electrically connected to pin 4.; Sim Note: Thermal Model provided is not called on from main Subckt.; Published: 8-Jun-2000; LatestRevisionDate: 17-Jul-2002; LatestRevisionNote: Re-released for DXP Platform.; DatasheetVersion: May-1998; PackageVersion: Feb-1997; PackageReference: TO-220AB; Publisher: Altium Limited; PackageDescription: TO, Thru-Hole, Vertical, Heatsink Mounted; 3 In-Line Leads; Pitch 2.54 mm; ComponentLink1Description: Manufacturer Link; ComponentLink1URL: http://www.irf.com/; ComponentLink2Description: Datasheet; ComponentLink2URL: http://www.irf.com/product-info/datasheets/data/irf3710.pdf
R1 RC1 RC2 = R
R001 R002 R005 R006 R010 R019 R031 R032 R033 R034 R037 R038 R039 R040 R41 R042 R42 R043 R43 R045 R046 R048 R049 R141-R143 = RES2
  R41-R43 R141-R143: value: 100
R003 R004 R007 R008 R011 R020 = R_390: Resistor; Published: 8-Jun-2000; LatestRevisionDate: 17-Jul-2002; LatestRevisionNote: Re-released for DXP Platform.; PackageReference: 0805; Publisher: Altium Limited; Value: 390
R107 R108 = SRES
R407 = Res2: Resistor; Manufacturer: Generic Components; Class I: Passive; Published: 8-Jun-2000; Revision: July-2002: Re-released for DXP Platform.; Publisher: Altium Limited; Class II: Resistor; Value: 1K 1/8W
S1 = U8
U1 = TMS320F283XXPGF_23: Part #: 101463-0176; Right: 690; Bottom: 720
U4 = 82C250: DEVICE: *; PACKAGE: *; MANUFACTURER: *
U5 = 74HCT240
U12 = OP284ES: Precision Rail-to-Rail Input and Output Operational Amplifier; Published: 8-Jun-2000; LatestRevisionDate: 13-Apr-2006; LatestRevisionNote: IPC-7351 Footprint Added.; DatasheetVersion: REV. 0 1996; PackageVersion: revA; PackageReference: SO-8; Publisher: Altium Limited; PackageDescription: 8-Pin Small Outline Integrated Circuit 1.27 mm Pitch; Code_JEDEC: MS-012-AA; Code_IPC: SOIC127P600-8; ComponentLink1Description: Manufacturer Link; ComponentLink1URL: http://www.analog.com/en/prod/0,,759_786_OP184%2C00.html; ComponentLink2Description: Datasheet; ComponentLink2URL: http://www.analog.com/UploadedFiles/Data_Sheets/390492658OP184_284_484_b.pdf; ComponentLink3Description: Discontinuation Notice; ComponentLink3URL: http://www.analog.com/UploadedFiles/Aerospace_Information/505817548385948813507767505obsolete.pdf
U13 = OP484ES: Precision Rail-to-Rail Input and Output Operational Amplifier; Published: 8-Jun-2000; LatestRevisionDate: 13-Apr-2006; LatestRevisionNote: IPC-7351 Footprint Added.; DatasheetVersion: REV. 0 1996; PackageVersion: revA; PackageReference: SO-14; Publisher: Altium Limited; PackageDescription: 14-Pin Small Outline Integrated Circuit 1.27 mm Pitch; Code_JEDEC: MS-012-AB; Code_IPC: SOIC127P600-14; ComponentLink1Description: Manufacturer Link; ComponentLink1URL: http://www.analog.com/en/prod/0,,759_786_OP184%2C00.html; ComponentLink2Description: Datasheet; ComponentLink2URL: http://www.analog.com/UploadedFiles/Data_Sheets/390492658OP184_284_484_b.pdf
U014 = Component_1
U41 U141 = AM26LS32/BEA(16): Quad Differential Line Receivers